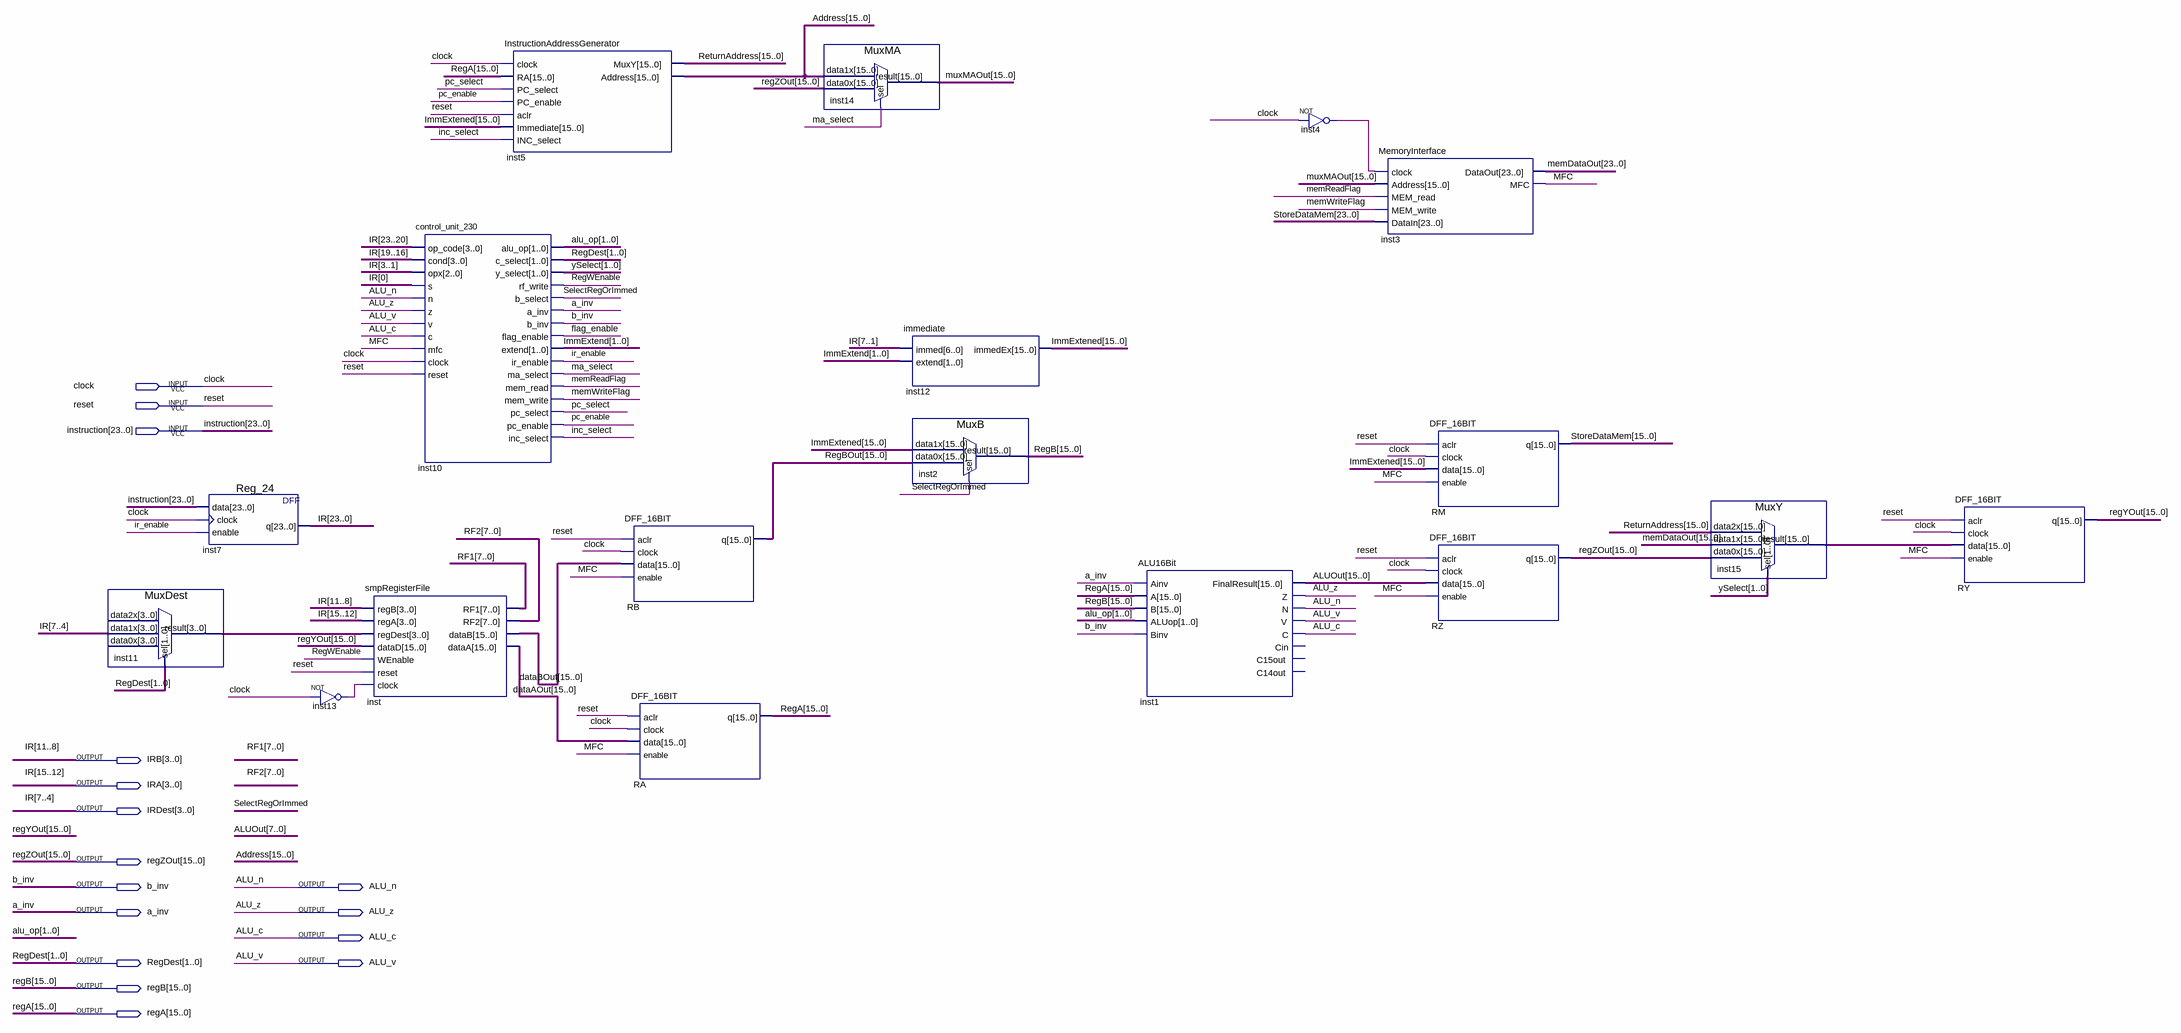
[diagram p0: schematic sheet]
// Quartus schematic ProcessorV1.bdf as structural Verilog: 18 symbols, 16 pins
module ProcessorV1 (
  input  clock,
  input  reset,
  input  [23:0] instruction,
  output [3:0] IRB,
  output [3:0] IRA,
  output [3:0] IRDest,
  output [15:0] regZOut,
  output b_inv,
  output ALU_n,
  output a_inv,
  output ALU_z,
  output ALU_c,
  output [1:0] RegDest,
  output ALU_v,
  output [15:0] regB,
  output [15:0] regA
);

  wire flag_enable, inc_select, inst4_out, inst13_out, ir_enable, ma_select, memReadFlag, memWriteFlag, MFC,
       pc_enable, pc_select, RegWEnable, SelectRegOrImmed;
  wire [1:0] alu_op, ImmExtend, ySelect;
  wire [3:0] inst11_result;
  wire [7:0] RF1, RF2;
  wire [15:0] Address, ALUOut, dataAOut, dataBOut, ImmExtened, inst15_result, muxMAOut, RegBOut, regYOut,
       ReturnAddress;
  wire [23:0] IR, memDataOut, StoreDataMem;

  MuxDest inst11 (.data1x(IRDest), .sel(RegDest), .result(inst11_result));  // open: data2x, data0x
  Reg_24 inst7 (.data(instruction), .clock(clock), .enable(ir_enable), .q({IR[23:16], IRA, IRB, IRDest, IR[3:0]}));
  not inst13 (inst13_out, clock);
  smpRegisterFile inst (
    .regB(IRB), .regA(IRA), .regDest(inst11_result), .dataD(regYOut), .WEnable(RegWEnable), .reset(reset),
    .clock(inst13_out), .RF1(RF1), .RF2(RF2), .dataB(dataBOut), .dataA(dataAOut));
  control_unit_230 inst10 (
    .op_code(IR[23:20]), .cond(IR[19:16]), .opx(IR[3:1]), .s(IR[0]), .n(ALU_n), .z(ALU_z), .v(ALU_v),
    .c(ALU_c), .mfc(MFC), .clock(clock), .reset(reset), .alu_op(alu_op), .c_select(RegDest),
    .y_select(ySelect), .rf_write(RegWEnable), .b_select(SelectRegOrImmed), .a_inv(a_inv), .b_inv(b_inv),
    .flag_enable(flag_enable), .extend(ImmExtend), .ir_enable(ir_enable), .ma_select(ma_select),
    .mem_read(memReadFlag), .mem_write(memWriteFlag), .pc_select(pc_select), .pc_enable(pc_enable),
    .inc_select(inc_select));
  InstructionAddressGenerator inst5 (
    .clock(clock), .RA(regA), .PC_select(pc_select), .PC_enable(pc_enable), .aclr(reset),
    .Immediate(ImmExtened), .INC_select(inc_select), .MuxY(ReturnAddress), .Address(Address));
  DFF_16BIT RB (.aclr(reset), .clock(clock), .data(dataBOut), .enable(MFC), .q(RegBOut));
  DFF_16BIT RA (.aclr(reset), .clock(clock), .data(dataAOut), .enable(MFC), .q(regA));
  MuxMA inst14 (.data1x(Address), .data0x(regZOut), .sel(ma_select), .result(muxMAOut));
  immediate inst12 (.immed({IRDest, IR[3:1]}), .extend(ImmExtend), .immedEx(ImmExtened));
  MuxB inst2 (.data1x(ImmExtened), .data0x(RegBOut), .sel(SelectRegOrImmed), .result(regB));
  ALU16Bit inst1 (
    .Ainv(a_inv), .A(regA), .B(regB), .ALUop(alu_op), .Binv(b_inv), .FinalResult(ALUOut), .Z(ALU_z),
    .N(ALU_n), .V(ALU_v), .C(ALU_c));  // open: Cin, C15out, C14out
  not inst4 (inst4_out, clock);
  MemoryInterface inst3 (
    .clock(inst4_out), .Address(muxMAOut), .MEM_read(memReadFlag), .MEM_write(memWriteFlag),
    .DataIn(StoreDataMem), .DataOut(memDataOut), .MFC(MFC));
  DFF_16BIT RM (.aclr(reset), .clock(clock), .data(ImmExtened), .enable(MFC), .q(StoreDataMem[15:0]));
  DFF_16BIT RZ (.aclr(reset), .clock(clock), .data(ALUOut), .enable(MFC), .q(regZOut));
  MuxY inst15 (
    .data2x(ReturnAddress), .data1x(memDataOut[15:0]), .data0x(regZOut), .sel(ySelect), .result(inst15_result));
  DFF_16BIT RY (.aclr(reset), .clock(clock), .data(inst15_result), .enable(MFC), .q(regYOut));

  // Other names for the same wires on the sheet: IR[15:4] = {IRA, IRB, IRDest}
endmodule
